# EAGLE design Sensor (EAGLE 7.7.0)
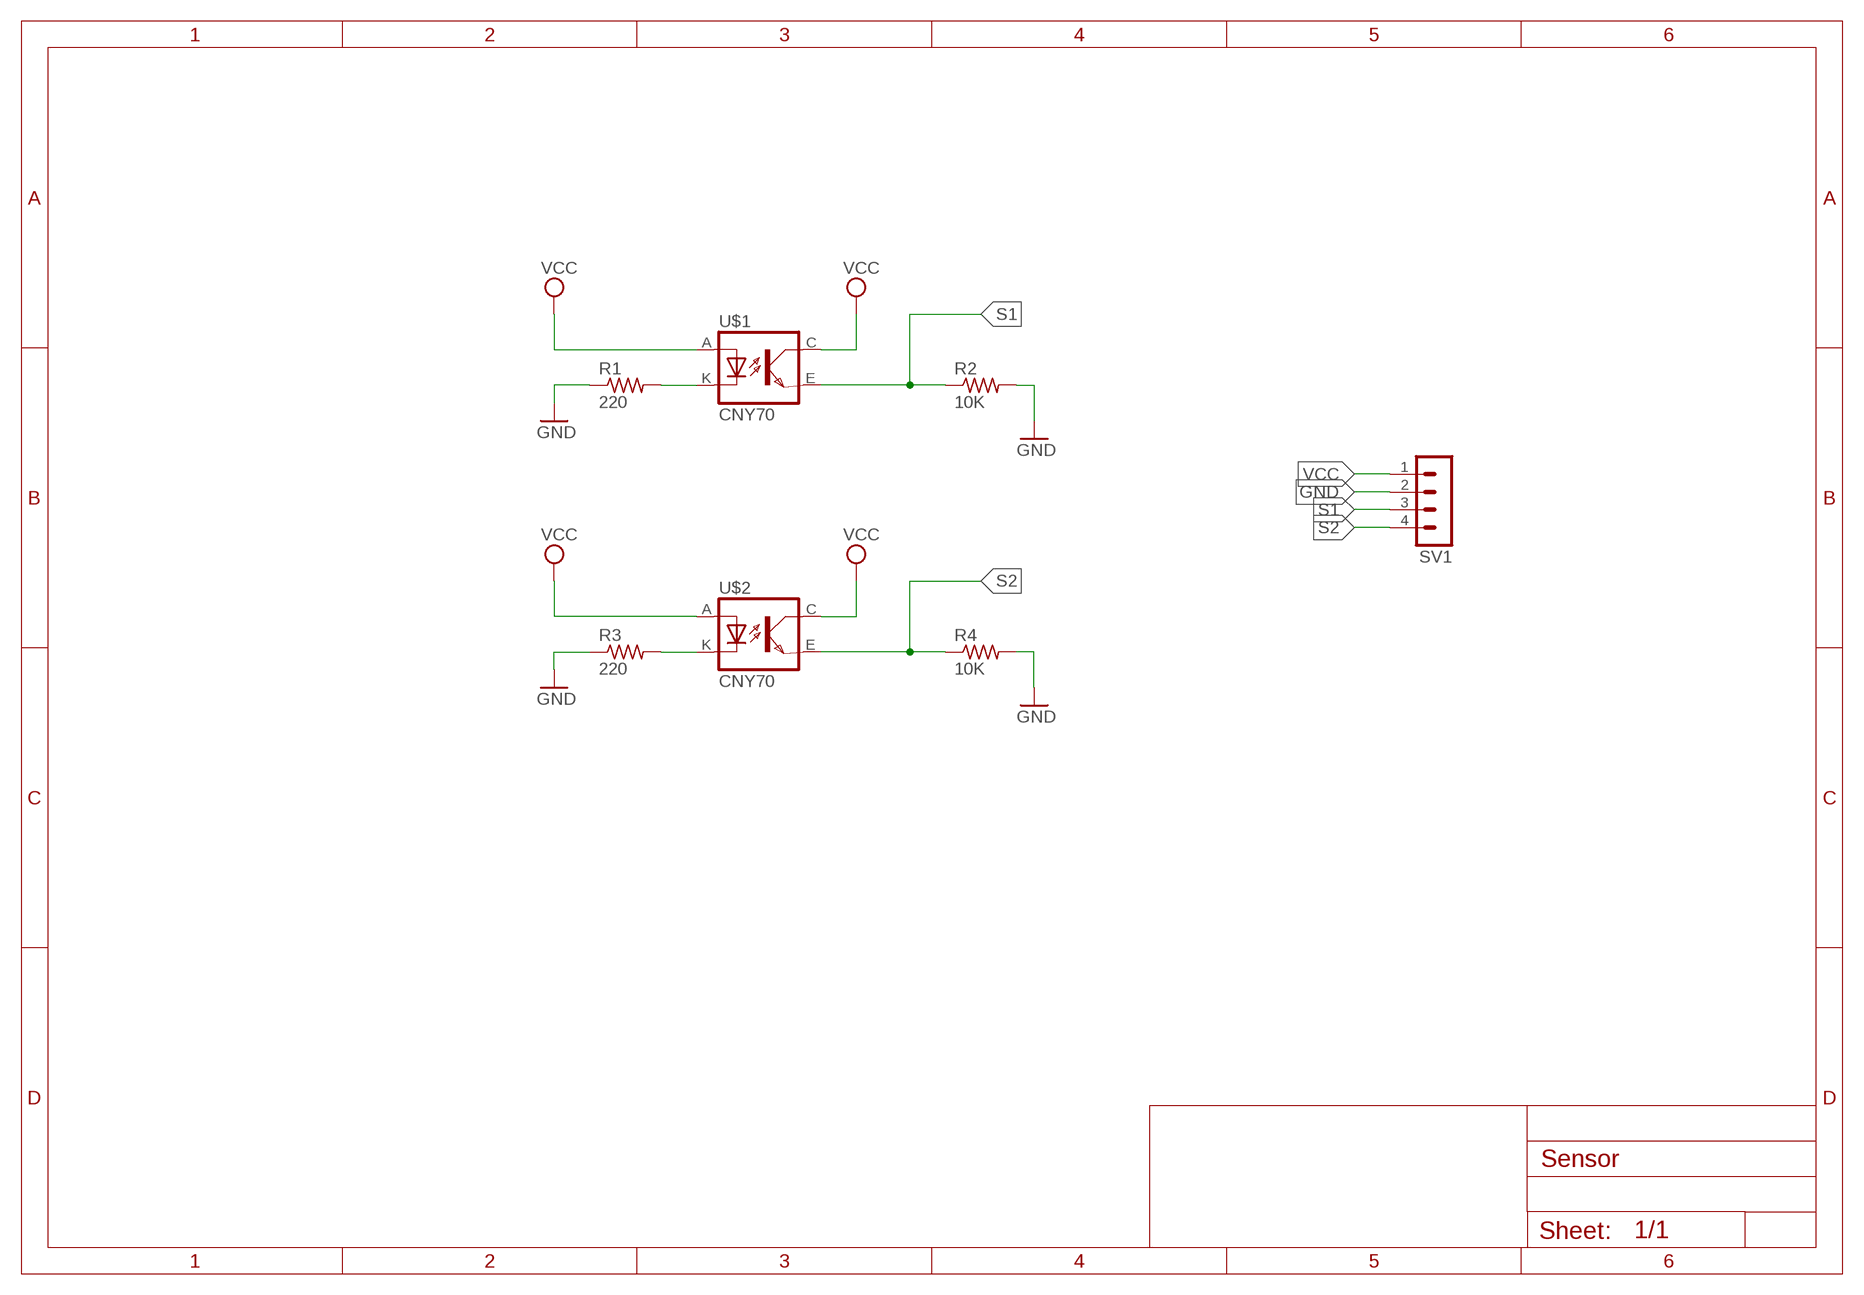
[diagram p0: schematic, sheet 1]

## Parts
R1  220  R-US_0207/10  [0207/10]
R2  10K  R-US_0207/10  [0207/10]
R3  220  R-US_0207/10  [0207/10]
R4  10K  R-US_0207/10  [0207/10]
SV1  MA04-1  [MA04-1]
U$1  CNY70  [4]
U$2  CNY70  [4]

## Nets
GND: R1.1 R2.2 R3.1 R4.2 SV1.2
N$2: R1.2 U$1.K(C)
N$3: R3.2 U$2.K(C)
S1: R2.1 SV1.3 U$1.E(EMI)
S2: R4.1 SV1.4 U$2.E(EMI)
VCC: SV1.1 U$1.A U$1.C(COL) U$2.A U$2.C(COL)

## Library data of the parts
R1-R4 = rcl:R-US_: RESISTOR, American symbol
SV1 = con-lstb:MA04-1: PIN HEADER; OC_FARNELL: unknown; OC_NEWARK: unknown
U$1 U$2 = cny70:CNY70

## Board
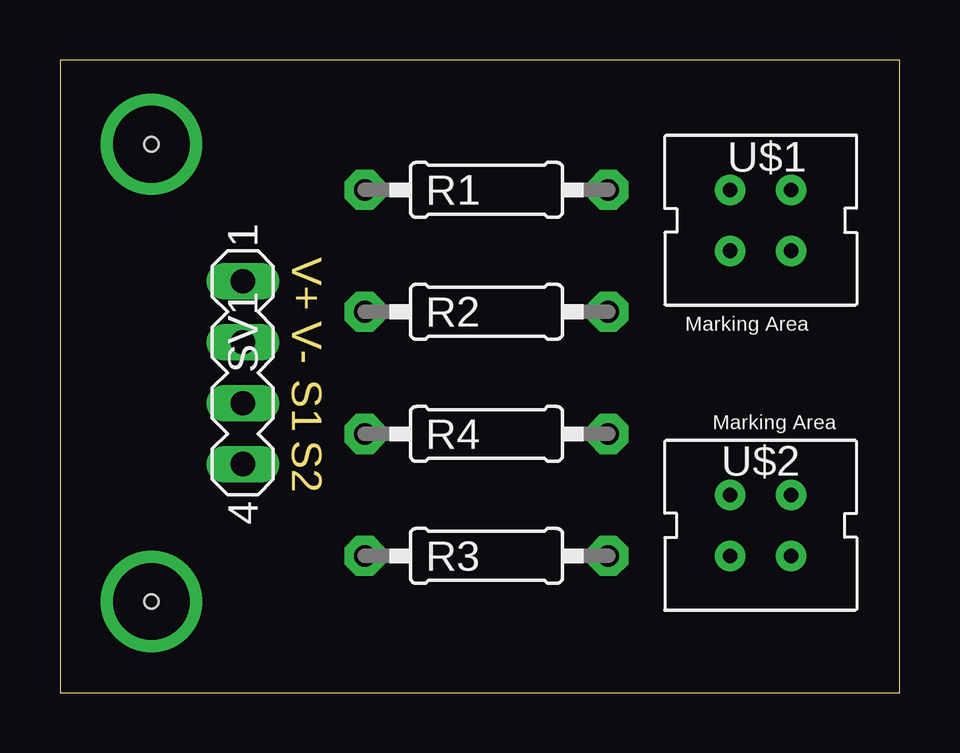
[diagram p1: board, top side]
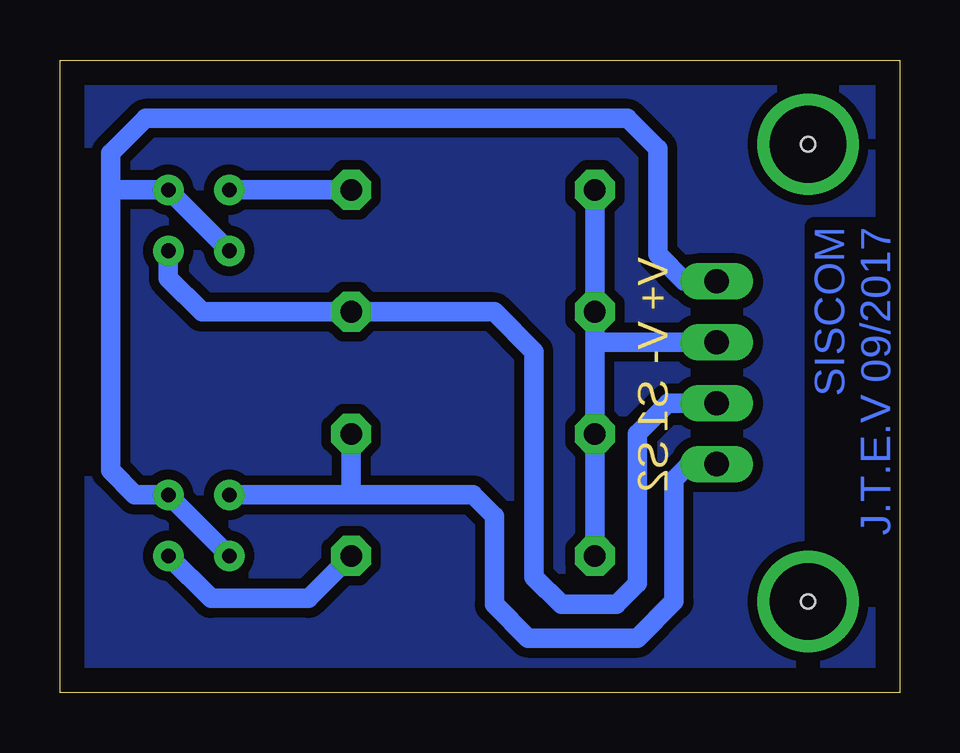
[diagram p2: board, bottom side, seen from below]

Size 35 x 26.37 mm. Coordinates in mm from the lower left corner, seen from the top.
Outline: 0,0 35,0 35,26.37 0,26.37 0,0
Copper layers (1*16): Top 0.035mm / dielectric 1.5mm / Bottom 0.035mm
Design rules "default": minimum track width 10mil, minimum drill 24mil, track to track 8mil, track to pad 8mil, pad to pad 8mil, via to via 8mil, smd to smd 8mil, copper to edge 40mil, drill to drill 8mil, minimum pad ring 10mil, minimum via ring 8mil, stop-mask expansion 4mil, vias tented up to drill 0mil, thermal gap 10mil
Holes 0.6 mm at 3.81,3.81 3.81,22.86

### Footprints (pad centres in the part's own frame; a part is rotated, then mirrored left to right if it is on the bottom)
0207/10 = drill 0.9 pad 1.676 octagon: 1 -5.08,0; 2 5.08,0
MA04-1 = drill 1.016 long: 1 -3.81,0; 2 -1.27,0; 3 1.27,0; 4 3.81,0
4 = drill 0.61 pad 1.27: A -1.27,1.27; C 1.27,-1.27; E 1.27,1.27; K -1.27,-1.27

### Placement (x,y rotation side)
R1  17.78,20.96 0 top
R2  17.78,15.88 180 top
R3  17.78,5.71 0 top
R4  17.78,10.79 180 top
SV1  7.62,13.34 270 top
U$1  29.21,19.69 270 top
U$2  29.21,6.98 90 top

### Tracks (layer width: path | path; a pad name or v marks a point on that pad's centre or on a via)
GND
  Bottom 0.813: R1.1 R2.2 12.7,14.61 | R3.1 R4.2 12.7,14.49 12.7,14.61 | SV1.2 12.7,14.61
N$1  (via drill 3.2 pad 3.81)
  other vias: 3.81,22.86
N$2
  Bottom 0.813: U$1.K R1.2
N$3
  Bottom 0.813: R3.2 24.64,3.94 28.71,3.94 U$2.K
N$4  (via drill 3.2 pad 3.81)
  other vias: 3.81,3.81
N$5
  pour Bottom (isolate 0.406): 0.13,26.29 35.05,26.29 35.05,0 0.13,0
S1
  Bottom 0.813: U$1.E 30.48,17.27 29.08,15.88 R2.1 16.89,15.88 15.24,14.22 15.24,4.83 14.1,3.68 11.81,3.68 10.92,4.57 10.92,10.79 9.65,12.07 SV1.3
S2
  Bottom 0.813: U$2.E 22.99,8.25 | 22.99,8.25 17.77,8.25 16.89,7.37 16.89,3.68 15.49,2.29 10.92,2.29 9.4,3.81 9.4,8.89 8.76,9.53 SV1.4 | R4.1 22.86,8.38 22.99,8.25
VCC
  Bottom 0.813: SV1.1 8.96,17.15 10.08,18.27 10.08,22.68 11.34,23.94 31.43,23.94 32.89,22.48 32.89,20.95 | 32.89,20.95 32.89,9.27 31.88,8.26 U$2.C U$2.A | 32.89,20.95 32.89,20.96 U$1.A U$1.C

### Text on the board
Bottom: SISCOM / J.T.E.V 09/2017
Dimension: V+ | V- | S1 | S2